# EAGLE design dashboard (EAGLE 7.6.0)

## Sheet 1 of 2

## Sheet 2 of 2
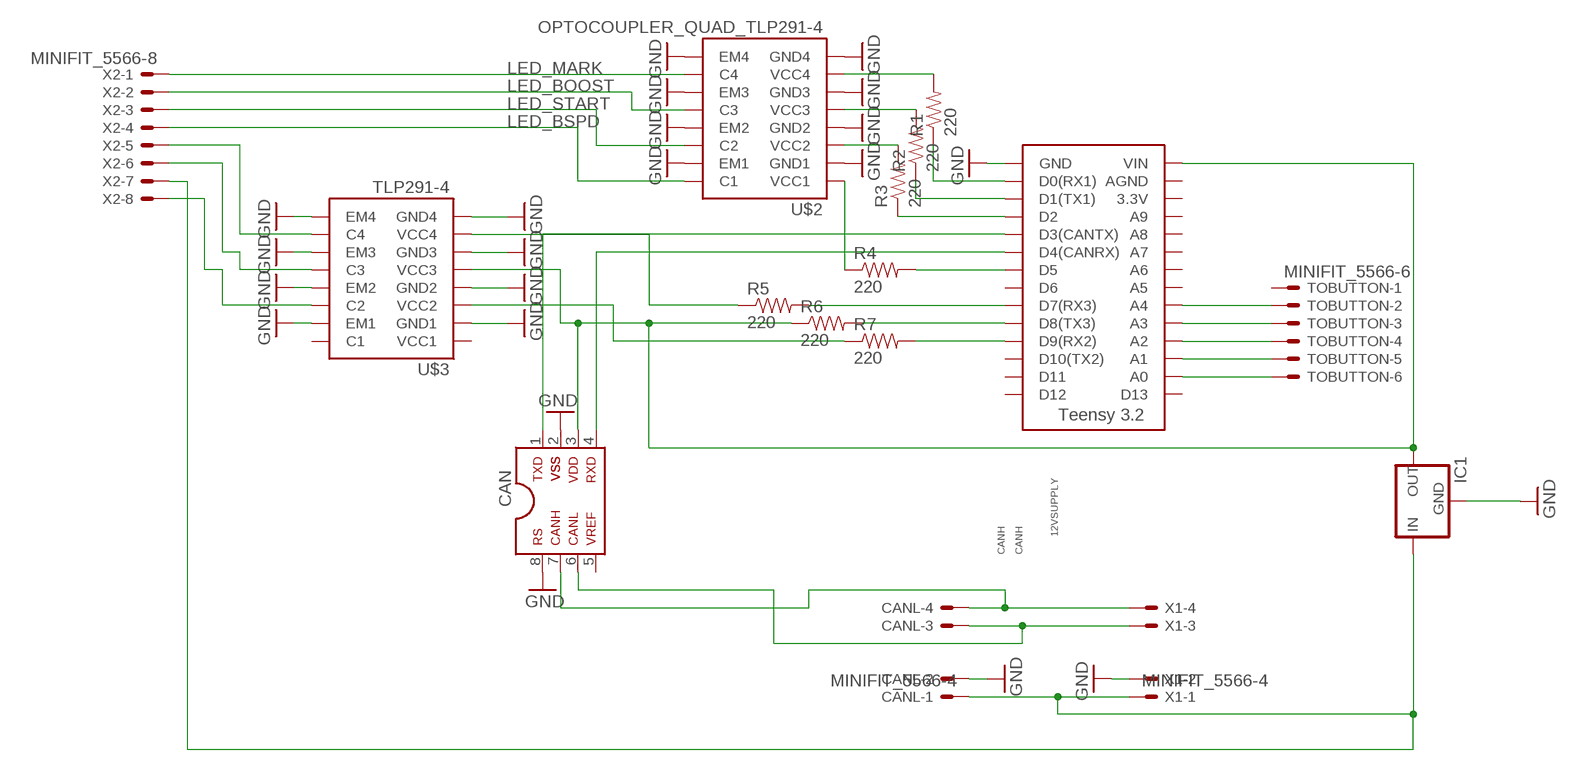
[diagram p0: schematic, sheet 2]

### Parts
CAN  MCP2551SOIC  [SOIC08]
CANL  MINIFIT_5566-4  [MINIFIT_5566-4]
IC1  5V_REGULATOR_LM340-NLM340MPX-5.0/NOPB  [SOT223]
R1  220  RESISTOR0805-RES  [0805]
R2  220  RESISTOR0805-RES  [0805]
R3  220  RESISTOR0805-RES  [0805]
R4  220  RESISTOR0805-RES  [0805]
R5  220  RESISTOR0805-RES  [0805]
R6  220  RESISTOR0805-RES  [0805]
R7  220  RESISTOR0805-RES  [0805]
TOBUTTON  MINIFIT_5566-6  [MINIFIT_5566-6]
U$1  TEENSY_3.2_SIMPLE  [TEENSY_3.2_SIMPLE]
U$2  OPTOCOUPLER_QUAD_TLP291-4  [SO-16]
U$3  TLP291-4  [SOIC-16]
X1  MINIFIT_5566-4  [MINIFIT_5566-4]
X2  MINIFIT_5566-8  [MINIFIT_5566-8]

### Nets
12VSUPPLY: CANL.1 IC1.1(IN) X1.1 X2.7
BOOST: TOBUTTON.3 U$1.A3
BUZZER: U$3.14(C2) X2.8
CANH: CAN.6 CANL.3 X1.3
CANL: CAN.7 CANL.4 X1.4
GND: CAN.2 CAN.8 CANL.2 IC1.2(GND) IC1.4(GND) U$1.GND U$2.2(GND1) U$2.4(GND2) U$2.6(GND3) U$2.8(GND4) U$2.9(EM4) U$2.11(EM3) U$2.13(EM2) U$2.15(EM1) U$3.2(GND1) U$3.4(GND2) U$3.6(GND3) U$3.8(GND4) U$3.9(EM4) U$3.11(EM3) U$3.13(EM2) U$3.15(EM1) X1.2
LED_BMS: U$3.12(C3) X2.6
LED_BOOST: U$2.12(C3) X2.2
LED_BSPD: U$2.16(C1) X2.4
LED_IMD: U$3.10(C4) X2.5
LED_MARK: U$2.10(C4) X2.1
LED_START: U$2.14(C2) X2.3
MARK: TOBUTTON.2 U$1.A4
N$1: R1.1 U$1.D0(RX1)
N$2: CAN.1 U$1.D3(CANTX)
N$3: CAN.4 U$1.D4(CANRX)
N$4: R2.1 U$1.D1(TX1)
N$5: R3.1 U$1.D2
N$7: R5.1 U$3.7(VCC4)
N$8: R4.1 U$2.1(VCC1)
N$9: R4.2 U$1.D5
N$13: R5.2 U$1.D7(RX3)
N$14: R6.2 U$1.D8(TX3)
N$15: R1.2 U$2.7(VCC4)
N$16: R2.2 U$2.5(VCC3)
N$17: R3.2 U$2.3(VCC2)
N$18: R7.2 U$1.D9(RX2)
N$19: CAN.3 IC1.3(OUT) R6.1 U$1.VIN U$3.5(VCC3)
N$22: R7.1 U$3.3(VCC2)
SELECT: TOBUTTON.6 U$1.A0
START: TOBUTTON.4 U$1.A2
TOGGLE: TOBUTTON.5 U$1.A1
Unconnected: CAN.5 TOBUTTON.1 U$1.3.3V U$1.A5 U$1.A6 U$1.A7 U$1.A8 U$1.A9 U$1.AGND U$1.D6 U$1.D10(TX2) U$1.D11 U$1.D12 U$1.D13 U$3.1(VCC1) U$3.16(C1)

## Library data of the parts
CAN = HyTechDevices:MCP2551: MCP2551 High-Speed CAN Transceiver Product Webpage <https://www.microchip.com/wwwproducts/en/MCP2551> Datasheet <http://ww1.microchip.com/downloads/en/DeviceDoc/21667f.pdf> This device is outdated It is replaced by MCP2561. Comparison Page <https://www.microchip.com/wwwproducts/ProductCompare/MCP2551/MCP2561> Product Webpage <https://www.microchip.com/wwwproducts/en/MCP2561> Datasheet <http://ww1.microchip.com/downloads/en/DeviceDoc/20005167C.pdf>
CANL X1 = HyTechDevices:MINIFIT_5566-4: Mini-Fit Junior connector 4 pole Source: http://www.molex.com; OC_FARNELL: unknown; OC_NEWARK: unknown
IC1 = HyTechDevices:5V_REGULATOR_LM340-N: Voltage Regulator 5v linear voltage regulator Datasheet <http://www.mouser.com/ProductDetail/Texas-Instruments/LM340MPX-50-NOPB/?qs=X1J7HmVL2ZGZwtTFRQ9ItA%3D%3D> MAX current out: 1.5A MAX voltage in: 35V
R1-R7 = HyTechDevices:RESISTOR: Resistor Basic schematic elements and footprints for 0603, 1206, and PTH resistors.
TOBUTTON = HyTechDevices:MINIFIT_5566-6: Mini-Fit Junior connector 6 pole Source: http://www.molex.com; MPN: 95566-61002; OC_FARNELL: unknown; OC_NEWARK: 22K8620
U$1 = HyTechDevices:TEENSY_3.2_SIMPLE: Simple version of the Teensy 3.2 board that only uses the 2 main rows of pins, not the inner pins or the pins opposite the usb port.
U$2 = HyTechDevices:OPTOCOUPLER_QUAD_TLP291-4
U$3 = HyTechDevices:TLP291-4: Toshiba Quad Channel Optocoupler TLP291-4
X2 = HyTechDevices:MINIFIT_5566-8: Mini-Fit Junior connector 8 pole Source: http://www.molex.com; OC_FARNELL: unknown; OC_NEWARK: unknown

## Board
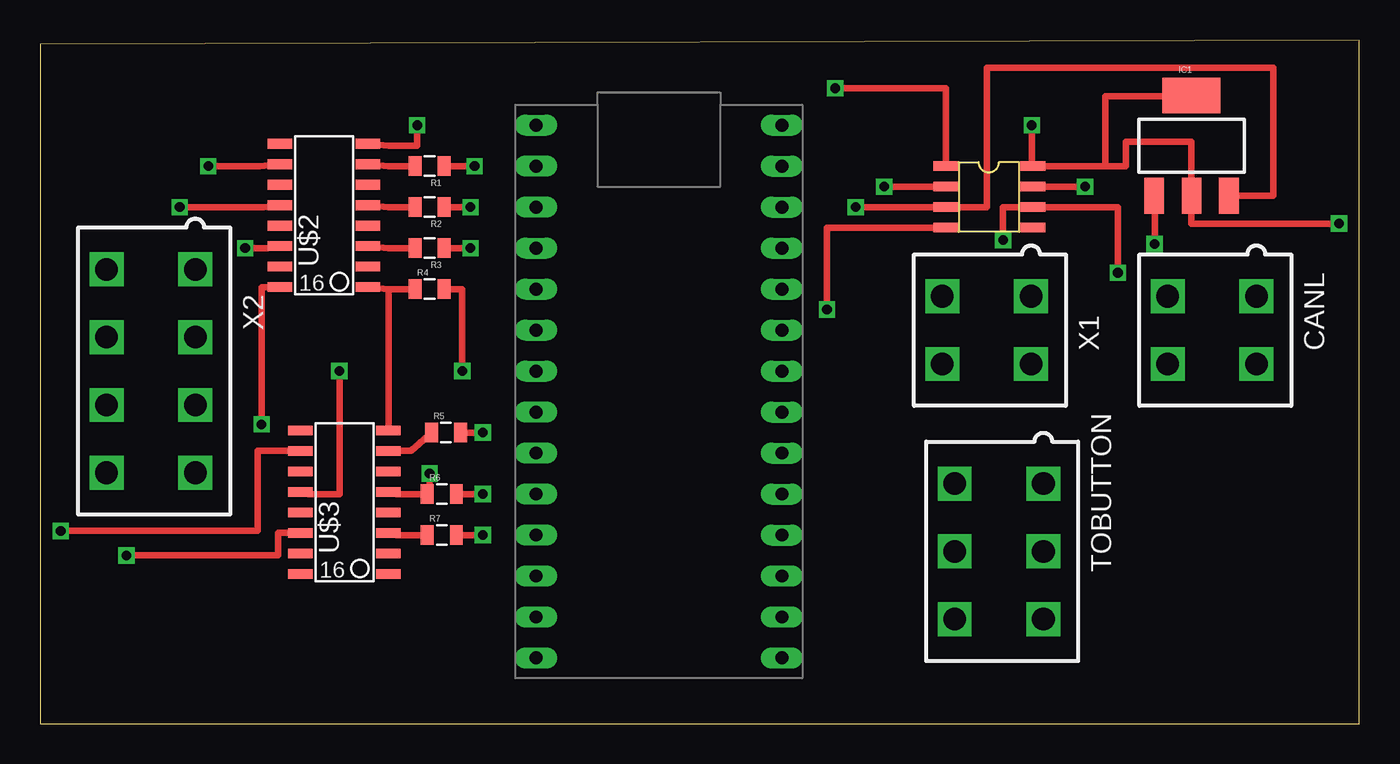
[diagram p1: board, top side]
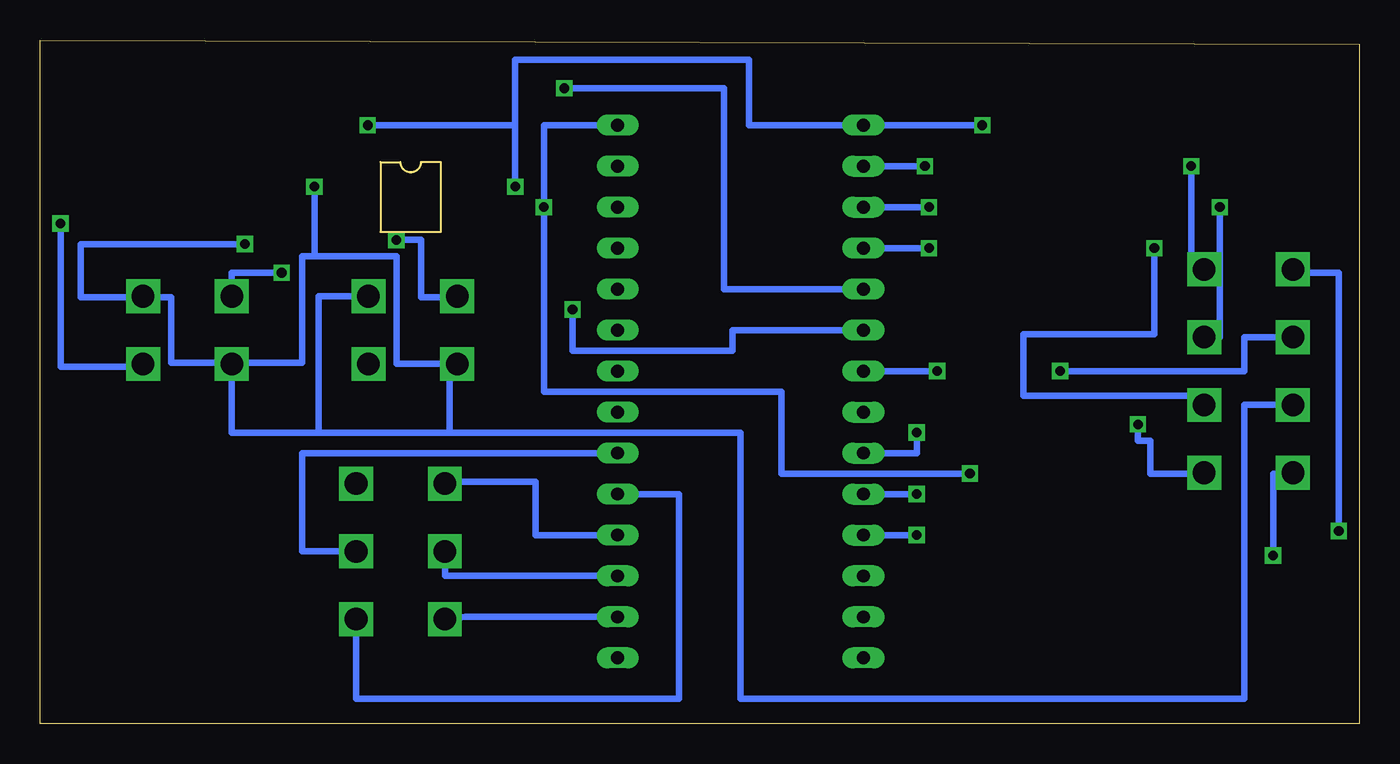
[diagram p2: board, bottom side, seen from below]

Size 81.77 x 42.34 mm. Coordinates in mm from the lower left corner, seen from the top.
Outline: 0,0 81.77,0 81.77,42.34 0,42.09 0,0
Copper layers (1*16): Top 0.035mm / dielectric 1.5mm / Bottom 0.035mm
Design rules "default": minimum track width 10mil, minimum drill 24mil, track to track 8mil, track to pad 8mil, pad to pad 8mil, via to via 8mil, smd to smd 8mil, copper to edge 40mil, drill to drill 8mil, minimum pad ring 10mil, minimum via ring 8mil, stop-mask expansion 4mil, vias tented up to drill 0mil, thermal gap 10mil

### Footprints (pad centres in the part's own frame; a part is rotated, then mirrored left to right if it is on the bottom)
SOIC08 = smd 0.6 x 1.55: 1 0,0; 2 1.27,0; 3 2.54,0; 4 3.81,0; 5 3.81,5.4; 6 2.54,5.4; 7 1.27,5.4; 8 0,5.4
MINIFIT_5566-4 = drill 1.4 square: 1 2.1,-2.75; 2 -2.1,-2.75; 3 2.1,2.75; 4 -2.1,2.75
SOT223 = smd 1.219 x 2.235: 1 -2.311,-3.099; 2 0,-3.099; 3 2.311,-3.099 | smd 3.6 x 2.2: 4 0,3.099
0805 = smd 0.8 x 1.2: 1 -0.9,0; 2 0.9,0
MINIFIT_5566-6 = drill 1.4 square: 1 4.2,-2.75; 2 0,-2.75; 3 -4.2,-2.75; 4 4.2,2.75; 5 0,2.75; 6 -4.2,2.75
TEENSY_3.2_SIMPLE = drill 0.8 long: 3.3V 16.51,29.21; A0 16.51,3.81; A1 16.51,6.35; A2 16.51,8.89; A3 16.51,11.43; A4 16.51,13.97; A5 16.51,16.51; A6 16.51,19.05; A7 16.51,21.59; A8 16.51,24.13; A9 16.51,26.67; AGND 16.51,31.75; D0(RX1) 1.27,31.75; D1(TX1) 1.27,29.21; D2 1.27,26.67; D3(CANTX) 1.27,24.13; D4(CANRX) 1.27,21.59; D5 1.27,19.05; D6 1.27,16.51; D7(RX3) 1.27,13.97; D8(TX3) 1.27,11.43; D9(RX2) 1.27,8.89; D10(TX2) 1.27,6.35; D11 1.27,3.81; D12 1.27,1.27; D13 16.51,1.27; GND 1.27,34.29; VIN 16.51,34.29
SO-16 = smd 0.61 x 1.524: 1 -4.445,-2.794; 2 -3.175,-2.794; 3 -1.905,-2.794; 4 -0.635,-2.794; 5 0.635,-2.794; 6 1.905,-2.794; 7 3.175,-2.794; 8 4.445,-2.794; 9 4.445,2.667; 10 3.175,2.667; 11 1.905,2.667; 12 0.635,2.667; 13 -0.635,2.667; 14 -1.905,2.667; 15 -3.175,2.667; 16 -4.445,2.667
SOIC-16 = smd 0.61 x 1.524: 1 -4.445,-2.794; 2 -3.175,-2.794; 3 -1.905,-2.794; 4 -0.635,-2.794; 5 0.635,-2.794; 6 1.905,-2.794; 7 3.175,-2.794; 8 4.445,-2.794; 9 4.445,2.667; 10 3.175,2.667; 11 1.905,2.667; 12 0.635,2.667; 13 -0.635,2.667; 14 -1.905,2.667; 15 -3.175,2.667; 16 -4.445,2.667
MINIFIT_5566-8 = drill 1.4 square: 1 6.3,-2.75; 2 2.1,-2.75; 3 -2.1,-2.75; 4 -6.3,-2.75; 5 6.3,2.75; 6 2.1,2.75; 7 -2.1,2.75; 8 -6.3,2.75

### Placement (x,y rotation side)
CAN  56.13,34.54 270 top
CANL  72.64,24.38 90 top
IC1  71.37,35.81 0 top
R1  24.13,34.54 180 top
R2  24.13,32 180 top
R3  24.13,29.46 180 top
R4  24.13,26.92 0 top
R5  25.15,18.03 0 top
R6  24.89,14.22 0 top
R7  24.89,11.68 0 top
TOBUTTON  59.44,10.67 90 top
U$1  29.46,2.79 0 top
U$2  17.53,31.5 90 top
U$3  18.8,13.72 90 top
X1  58.67,24.38 90 top
X2  6.86,21.84 90 top

### Tracks (layer width: path | path; a pad name or v marks a point on that pad's centre or on a via)
12VSUPPLY  (via drill 0.6)
  Top 0.406: IC1.1 69.09,32.72 v69.09,29.72
  Bottom 0.406: 56.39,22.28 56.39,18.03 | 56.39,18.03 64.52,18.03 | X2.7 7.11,19.74 7.11,1.52 38.35,1.52 38.35,18.03 56.39,18.03 | X1.1 64.52,26.48 64.52,18.03 | 64.52,18.03 69.89,18.03 69.89,22.35 73.66,22.35 73.66,26.42 75.39,26.42 | v69.09,29.72 79.25,29.72 79.25,26.42 75.39,26.42 | 75.39,26.42 CANL.1
BOOST
  Bottom 0.406: U$1.A3 42.16,14.22 42.16,1.52 62.19,1.52 TOBUTTON.3
BUZZER  (via drill 0.6)
  Top 0.406: U$3.14 14.73,11.81 14.73,10.41 v5.33,10.41
  Bottom 0.406: v5.33,10.41 5.33,15.49 5.12,15.49 X2.8
CANH  (via drill 0.6)
  Top 0.406: v66.8,27.94 66.8,32 CAN.6 59.69,32 v59.69,29.97
  Bottom 0.406: v66.8,27.94 69.89,27.94 CANL.3 | v59.69,29.97 58.17,29.97 58.17,26.42 55.92,26.42 X1.3
CANL  (via drill 0.6)
  Top 0.406: v64.77,33.27 CAN.7
  Bottom 0.406: 64.77,28.96 59.69,28.96 59.69,22.28 X1.4 | 64.77,28.96 v64.77,33.27 | 64.77,28.96 65.53,28.96 65.53,22.35 69.89,22.35 CANL.4
GND  (via drill 0.6)
  Top 0.406: U$2.8 21.59,35.81 23.37,35.81 v23.37,37.08 | 21.59,26.92 U$3.8 | v52.32,33.27 CAN.2 | 66.04,34.54 CAN.8 61.47,34.54 v61.47,37.08 | 66.04,34.54 66.04,38.86 71.37,38.86 IC1.4 | 66.04,34.54 67.31,34.54 67.31,36.07 71.37,36.07 IC1.2 71.37,30.99 v80.52,30.99
  Bottom 0.406: 52.32,37.08 52.32,41.15 37.85,41.15 37.85,37.08 U$1.GND v23.37,37.08 | 52.32,37.08 v52.32,33.27 | v61.47,37.08 52.32,37.08 | v80.52,30.99 80.52,22.1 75.39,22.1 CANL.2
  cutout Top: -1.02,42.16 -0.76,-1.27 83.06,-1.27 82.8,43.43 -1.02,43.43
  cutout Bottom: -2.29,43.43 -2.29,-2.29 84.07,-2.29 84.07,44.7 -2.29,44.7
LED_BMS  (via drill 0.6)
  Top 0.406: v18.54,21.84 18.54,14.22 16.64,14.22 U$3.12
  Bottom 0.406: X2.6 7.11,23.94 7.11,21.84 v18.54,21.84
LED_BOOST  (via drill 0.6)
  Top 0.406: v8.64,32 13.84,32 U$2.12
  Bottom 0.406: X2.2 8.64,23.94 v8.64,32
LED_BSPD  (via drill 0.6)
  Top 0.406: U$2.16 13.72,27.05 v13.72,18.54
  Bottom 0.406: v13.72,18.54 13.72,17.53 12.95,17.53 12.95,15.49 10.62,15.49 X2.4
LED_IMD  (via drill 0.6)
  Top 0.406: U$3.10 13.46,16.89 13.46,11.94 v1.27,11.94
  Bottom 0.406: v1.27,11.94 1.27,27.94 4.11,27.94 X2.5
LED_MARK  (via drill 0.6)
  Top 0.406: v10.41,34.54 13.59,34.54 U$2.10
  Bottom 0.406: X2.1 10.41,28.14 v10.41,34.54
LED_START  (via drill 0.6)
  Top 0.406: v12.7,29.46 14.1,29.46 U$2.14
  Bottom 0.406: X2.3 10.16,19.74 10.16,20.32 20.83,20.32 20.83,24.13 12.7,24.13 v12.7,29.46
MARK
  Bottom 0.406: U$1.A4 65.53,16.76 65.53,10.67 TOBUTTON.2
N$1  (via drill 0.6)
  Top 0.406: R1.1 v26.92,34.54
  Bottom 0.406: v26.92,34.54 U$1.D0(RX1)
N$2  (via drill 0.6)
  Top 0.406: v49.28,39.37 56.13,39.37 CAN.1
  Bottom 0.406: v49.28,39.37 39.37,39.37 39.37,26.92 U$1.D3(CANTX)
N$3  (via drill 0.6)
  Top 0.406: CAN.4 48.77,30.73 v48.77,25.65
  Bottom 0.406: v48.77,25.65 48.77,23.11 38.86,23.11 38.86,24.38 U$1.D4(CANRX)
N$4  (via drill 0.6)
  Top 0.406: R2.1 v26.67,32
  Bottom 0.406: v26.67,32 U$1.D1(TX1)
N$5  (via drill 0.6)
  Top 0.406: R3.1 v26.67,29.46
  Bottom 0.406: v26.67,29.46 U$1.D2
N$7
  Top 0.406: U$3.7 22.98,16.89 R5.1
N$8
  Top 0.406: 23.37,26.92 R4.1 21.59,26.92 U$2.1
N$9  (via drill 0.6)
  Top 0.406: R4.2 26.16,26.92 v26.16,21.84
  Bottom 0.406: v26.16,21.84 U$1.D5
N$13  (via drill 0.6)
  Top 0.406: R5.2 v27.43,18.03
  Bottom 0.406: v27.43,18.03 27.43,16.76 U$1.D7(RX3)
N$14  (via drill 0.6)
  Top 0.406: R6.2 v27.43,14.22
  Bottom 0.406: v27.43,14.22 U$1.D8(TX3)
N$15
  Top 0.406: R1.2 21.59,34.54 U$2.7
N$16
  Top 0.406: R2.2 21.59,32 U$2.5
N$17
  Top 0.406: R3.2 21.59,29.46 U$2.3
N$18  (via drill 0.6)
  Top 0.406: R7.2 v27.43,11.68
  Bottom 0.406: v27.43,11.68 U$1.D9(RX2)
N$19  (via drill 0.6)
  Top 0.406: IC1.3 76.45,32.72 76.45,40.64 58.67,40.64 58.67,32 CAN.3 v50.55,32 | U$3.5 22.1,14.22 R6.1 24.13,14.22 v24.13,15.49
  Bottom 0.406: v24.13,15.49 35.81,15.49 35.81,20.57 50.55,20.57 v50.55,32 50.55,37.08 U$1.VIN
N$22
  Top 0.406: R7.1 22.1,11.68 U$3.3
SELECT
  Bottom 0.406: U$1.A0 55.42,6.6 TOBUTTON.6
START
  Bottom 0.406: U$1.A2 51.05,11.68 51.05,14.99 56.69,14.99 TOBUTTON.4
TOGGLE
  Bottom 0.406: U$1.A1 56.69,9.14 TOBUTTON.5